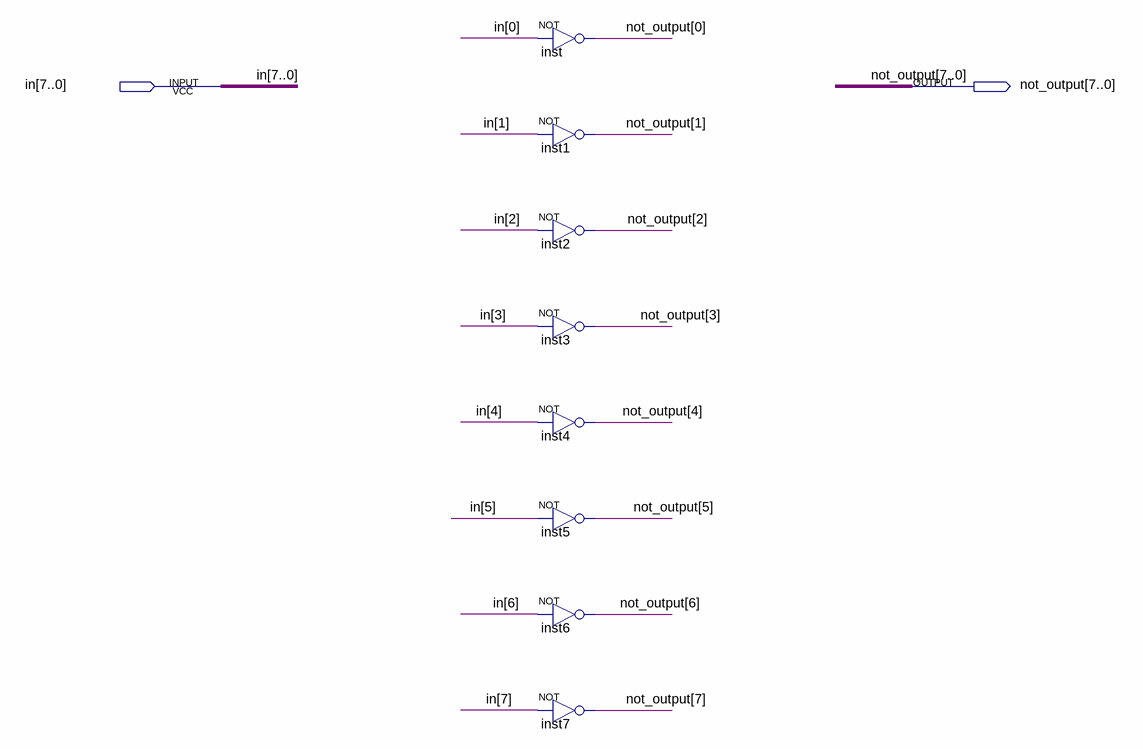
[diagram p0: schematic sheet]
// Quartus schematic NOT_8bit.bdf as structural Verilog: 8 symbols, 2 pins
module NOT_8bit (
  input  [7:0] in,
  output [7:0] not_output
);

  not inst (not_output[0], in[0]);
  not inst1 (not_output[1], in[1]);
  not inst2 (not_output[2], in[2]);
  not inst3 (not_output[3], in[3]);
  not inst4 (not_output[4], in[4]);
  not inst5 (not_output[5], in[5]);
  not inst6 (not_output[6], in[6]);
  not inst7 (not_output[7], in[7]);
endmodule
